# EAGLE design OnOnfre_dual_parafuso_estores_beta (EAGLE 8.6.0)
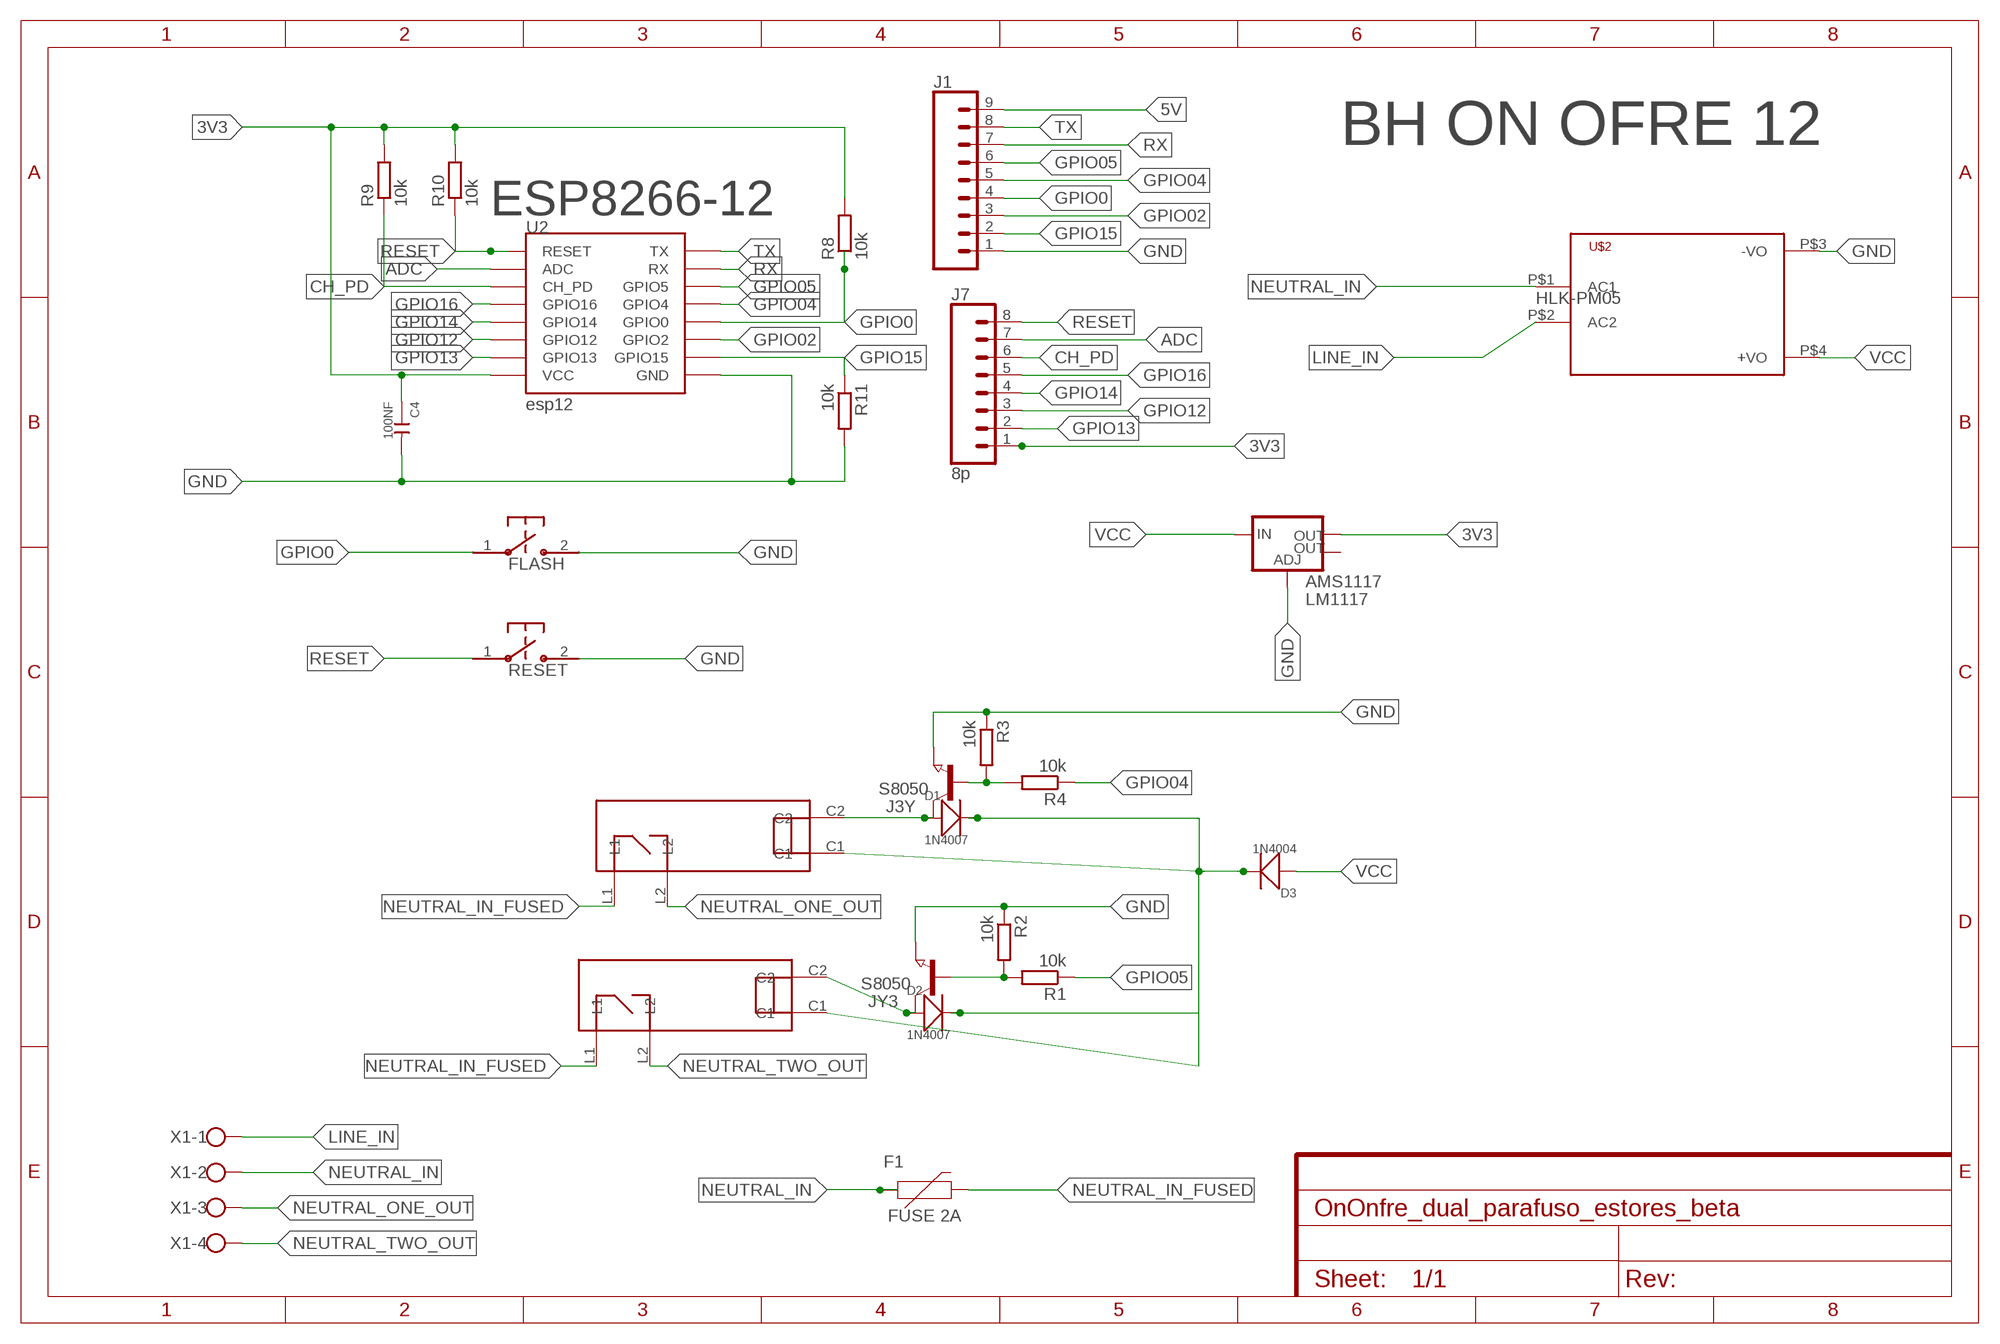
[diagram p0: schematic, sheet 1]

## Parts
AMS1117  LM1117  V_REG_LM1117SOT223  [SOT223]
C4  100NF  CERAMIC-1NF-1KV-10%-X7R(1206)  [C1206]
D1  1N4007  DIODE-GEN-PURPOSE-1KV-1A(DO-214AC)  [DO-214AC]
D2  1N4007  DIODE-GEN-PURPOSE-1KV-1A(DO-214AC)  [DO-214AC]
D3  1N4004  DIODE-GEN-PURPOSE-1KV-1A(DO-214AC)  [DO-214AC]
F1  FUSE 2A  PPTC_PTH  [PTH]
FLASH  B3U-1000P-2P-SMD  B3U-1000P  [B3U-1000P]
J1  CONN_09  [1X09]
J3Y  S8050  NPN-TRANSISTOR_SOT23  [SOT23]
J7  8p  CONN_08"  [1X08]
JY3  S8050  NPN-TRANSISTOR_SOT23  [SOT23]
R1  10k  R-EU_R0603  [R0603]
R2  10k  R-EU_R0603  [R0603]
R3  10k  R-EU_R0603  [R0603]
R4  10k  R-EU_R0603  [R0603]
R8  10k  R-EU_R0603  [R0603]
R9  10k  R-EU_R0603  [R0603]
R10  10k  R-EU_R0603  [R0603]
R11  10k  R-EU_R0603  [R0603]
RESET  B3U-1000P-2P-SMD  B3U-1000P  [B3U-1000P]
U2  esp12  ESP12SMD  [ESP12-SMD]
U$1  HF46F  [HF46F]
U$2  HKLPM01  [HKLPM01]
U$3  HF46F  [HF46F]
X1  W237-4  [W237-4]

## Nets
3V3: AMS1117.2(OUT) C4.1 J7.1 R8.2 R9.2 R10.2 U2.VCC
5V: D1.2(-) D2.2(-) D3.2(-) J1.9 U$1.C1 U$3.C1
ADC: J7.7 U2.ADC
CH_PD: J7.6 R9.1 U2.CH_PD
GND: AMS1117.1(ADJ) C4.2 FLASH.2 J1.1 J3Y.2(E) JY3.2(E) R2.1 R3.1 R11.2 RESET.2 U2.GND U$2.P$3(-VO)
GPIO0: FLASH.1 J1.4 R8.1 U2.GPIO0
GPIO02: J1.3 U2.GPIO2
GPIO04: J1.5 R4.1 U2.GPIO4
GPIO05: J1.6 R1.1 U2.GPIO5
GPIO12: J7.3 U2.GPIO12
GPIO13: J7.2 U2.GPIO13
GPIO14: J7.4 U2.GPIO14
GPIO15: J1.2 R11.1 U2.GPIO15
GPIO16: J7.5 U2.GPIO16
LINE_IN [220V]: U$2.P$2(AC2) X1.1
N$1: D1.1(+) J3Y.3(C) U$1.C2
N$7: J3Y.1(B) R3.2 R4.2
N$9: D2.1(+) JY3.3(C) U$3.C2
N$13: JY3.1(B) R1.2 R2.2
NEUTRAL_IN [220V]: F1.P$1 U$2.P$1(AC1) X1.2
NEUTRAL_IN_FUSED: F1.P$2 U$1.L1 U$3.L1
NEUTRAL_ONE_OUT [220V]: U$1.L2 X1.3
NEUTRAL_TWO_OUT [220V]: U$3.L2 X1.4
RESET: J7.8 R10.1 RESET.1 U2.RESET
RX: J1.7 U2.RXD0(RX)
TX: J1.8 U2.TXD0(TX)
VCC: AMS1117.3(IN) D3.1(+) U$2.P$4(+VO)
Unconnected: AMS1117.4(OUT)

## Notes on the sheet
- BH ON OFRE 12
- ESP8266-12
- HLK-PM05

## Library data of the parts
AMS1117 = SparkFun-IC-Power:V_REG_LM1117: Voltage Regulator LM1117 Standard adjustable voltage regulator but in SMD form. Spark Fun Electronics SKU : COM-00595; PROD_ID: VREG-08170
C4 = Seeed-Capacitor:CERAMIC-1NF-1KV-10%-X7R?(1206): 302010189; MPN: CC1206KKX7RCBB102; VALUE: 1NF
D1 D2 = Seeed-Diode:DIODE-GEN-PURPOSE-1KV-1A(DO-214AC): 304010013; MPN: 1N4007
D3 = Seeed-Diode:DIODE-GEN-PURPOSE-1KV-1A(DO-214AC): 304010013; MPN: 1N4007; VALUE: 1N4007
F1 = SparkFun-Fuses:PPTC: Resettable Fuse PPTC Resettable Fuse. Really a sort of resistor with a polymeric positive temperature coefficient whose resistance increases dramatically with an increase in temperature. When heated by the power passing through the resistance rises causing the current to be limited, protecting the circuit. This is achieved by the transition of the polymer from a crystalline to an amorphous state where the conductive carbon separates breaking the conductive pathways found in the cool crystalline structure. When a PPTC cools back down it resumes conducting letting the circuit turn back on. SparkFun Products: SparkFun RedBoard - Programmed with Arduino <https://www.sparkfun.com/products/12757> Pro Micro - 5V/16MHz <https://www.sparkfun.com/products/12640> Arduino Pro 328 - 5V/16MHz <https://www.sparkfun.com/products/10915> MP3 Trigger <https://www.sparkfun.com/products/13720>; PROD_ID: RES-08490; VALUE: 72V/0.25A
FLASH RESET = switches:B3U: Switch; DIGIKEY: SW1020CT-ND; MANUFACTURER: Omron; MPN: B3U-1000P
J1 = SparkFun-Connectors:CONN_09: Multi connection point. Often used as Generic Header-pin footprint for 0.1 inch spaced/style header connections On any of the 0.1 inch spaced packages, you can populate with these: Break Away Headers - Straight <https://www.sparkfun.com/products/116> (PRT-00116) Break Away Male Headers - Right Angle <https://www.sparkfun.com/products/553> (PRT-00553) Female Headers <https://www.sparkfun.com/products/115> (PRT-00115) Break Away Headers - Machine Pin <https://www.sparkfun.com/products/117> (PRT-00117) Break Away Female Headers - Swiss Machine Pin <https://www.sparkfun.com/products/743> (PRT-00743) For SCREWTERMINALS and SPRING TERMINALS visit here: Screw Terimnals on SparkFun.com <https://www.sparkfun.com/search/results?term=Screw+Terminals> (5mm/3.5mm/2.54mm spacing) This device is also useful as a general connection point to wire up your design to another part of your project. Our various solder wires solder well into these plated through hole pads. Hook-Up Wire - Assortment (Stranded, 22 AWG) <https://www.sparkfun.com/products/11375> (PRT-11375) Hook-Up Wire - Assortment (Solid Core, 22 AWG) <https://www.sparkfun.com/products/11367> (PRT-11367) View the entire wire category on our website here <https://www.sparkfun.com/categories/141> Special notes: Molex polarized connector foot print use with SKU : PRT-08231 with associated crimp pins and housings. 1MM SMD Version SKU: PRT-10208 NOTES ON THE VARIANTS LOCK and LOCK_LONGPADS... This footprint was designed to help hold the alignment of a through-hole component (i.e. 6-pin header) while soldering it into place. You may notice that each hole has been shifted either up or down by 0.005 of an inch from it's more standard position (which is a perfectly straight line). This slight alteration caused the pins (the squares in the middle) to touch the edges of the holes. Because they are alternating, it causes a "brace" to hold the component in place. 0.005 has proven to be the perfect amount of "off-center" position when using our standard breakaway headers. Although looks a little odd when you look at the bare footprint, once you have a header in there, the alteration is very hard to notice. Also,if you push a header all the way into place, it is covered up entirely on the bottom side.
J3Y JY3 = semicon-smd-ipc:NPN-TRANSISTOR_: NPN TRANSISTOR
J7 = SparkFun-Connectors:CONN_08: Multi connection point. Often used as Generic Header-pin footprint for 0.1 inch spaced/style header connections On any of the 0.1 inch spaced packages, you can populate with these: Break Away Headers - Straight <https://www.sparkfun.com/products/116> (PRT-00116) Break Away Male Headers - Right Angle <https://www.sparkfun.com/products/553> (PRT-00553) Female Headers <https://www.sparkfun.com/products/115> (PRT-00115) Break Away Headers - Machine Pin <https://www.sparkfun.com/products/117> (PRT-00117) Break Away Female Headers - Swiss Machine Pin <https://www.sparkfun.com/products/743> (PRT-00743) Arduino Stackable Header - 8 Pin <https://www.sparkfun.com/products/9279> (PRT-09279) For SCREWTERMINALS and SPRING TERMINALS visit here: Screw Terimnals on SparkFun.com <https://www.sparkfun.com/search/results?term=Screw+Terminals> (5mm/3.5mm/2.54mm spacing) This device is also useful as a general connection point to wire up your design to another part of your project. Our various solder wires solder well into these plated through hole pads. Hook-Up Wire - Assortment (Stranded, 22 AWG) <https://www.sparkfun.com/products/11375> (PRT-11375) Hook-Up Wire - Assortment (Solid Core, 22 AWG) <https://www.sparkfun.com/products/11367> (PRT-11367) View the entire wire category on our website here <https://www.sparkfun.com/categories/141> Special notes: Molex polarized connector foot print use with SKU : PRT-08231 with associated crimp pins and housings. 1MM SMD Version SKU: PRT-10208 NOTES ON THE VARIANTS LOCK and LOCK_LONGPADS... This footprint was designed to help hold the alignment of a through-hole component (i.e. 6-pin header) while soldering it into place. You may notice that each hole has been shifted either up or down by 0.005 of an inch from it's more standard position (which is a perfectly straight line). This slight alteration caused the pins (the squares in the middle) to touch the edges of the holes. Because they are alternating, it causes a "brace" to hold the component in place. 0.005 has proven to be the perfect amount of "off-center" position when using our standard breakaway headers. Although looks a little odd when you look at the bare footprint, once you have a header in there, the alteration is very hard to notice. Also,if you push a header all the way into place, it is covered up entirely on the bottom side.; PROD_ID: CONN-08438
R1-R4 R8-R11 = resistor:R-EU_: RESISTOR, European symbol
U2 = esp8266modules:ESP12: ESP8266 Wifi module 12
U$1 U$3 = HF46F:HF46F
U$2 = HKLPM01:HKLPM01
X1 = con-wago-500:W237-4: WAGO SCREW CLAMP; OC_FARNELL: unknown; OC_NEWARK: unknown

## Net classes
1 220V: width 1.27 mm, clearance 2 mm

## Board
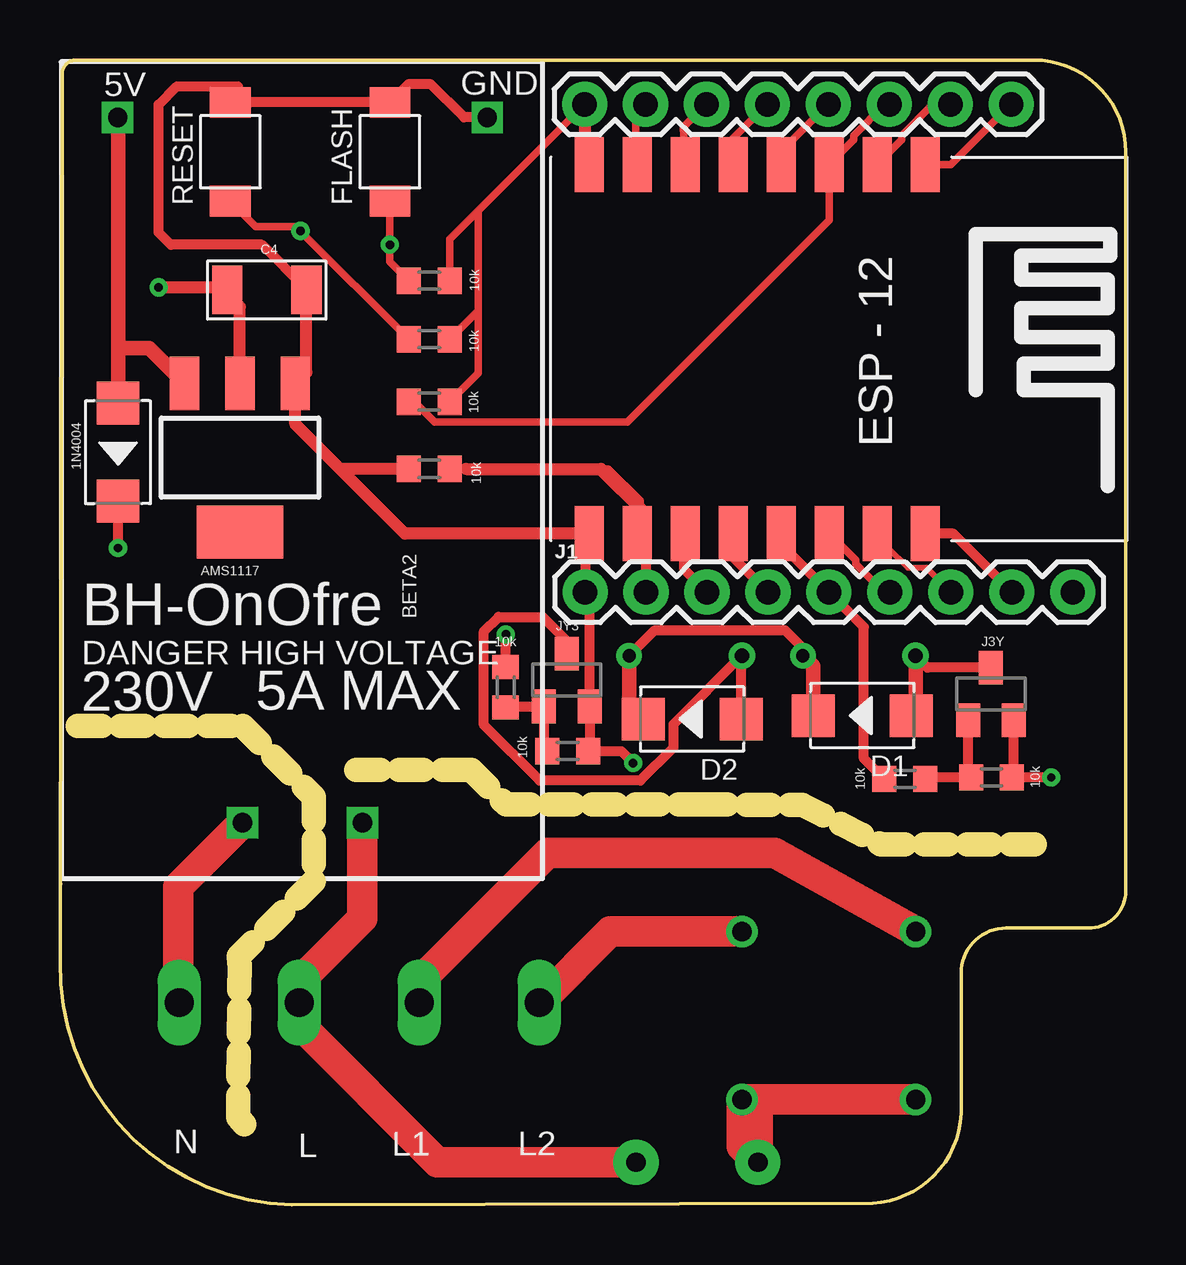
[diagram p1: board, top side]
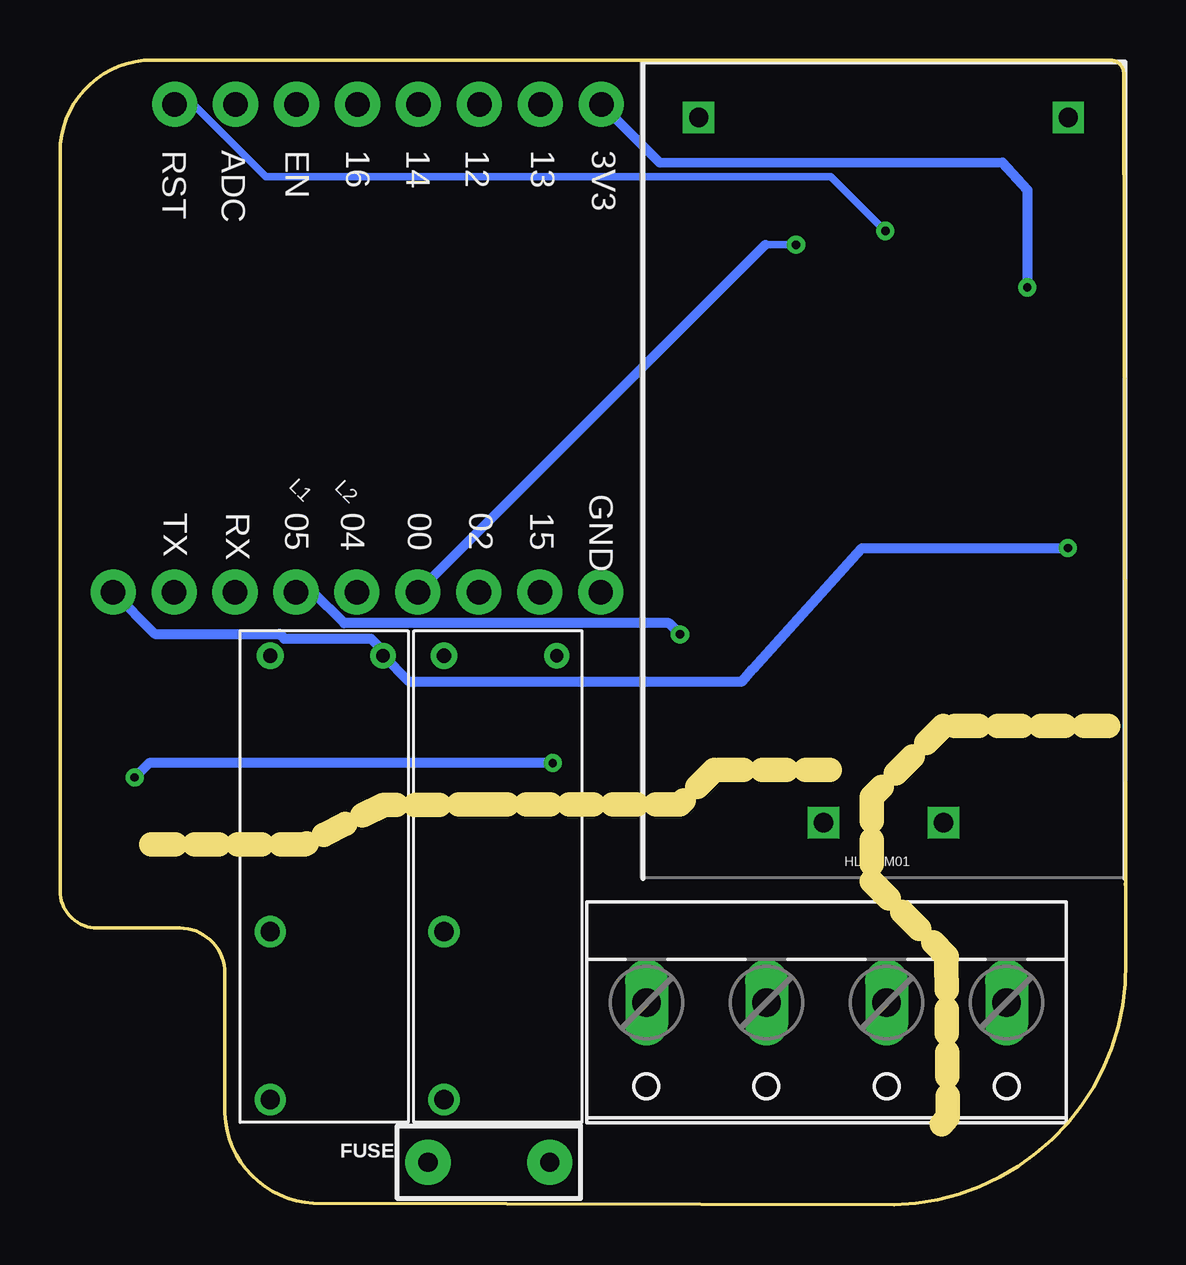
[diagram p2: board, bottom side, seen from below]

Size 44.41 x 47.73 mm. Coordinates in mm from the lower left corner, seen from the top.
Outline: 0.01,13.43 0.01,13.34
Outline: 0.01,13.34 0.01,10.14 arc90 9.66,0 33.86,0.08 arc90 37.54,4.18 37.54,9.66 arc-90 39.42,11.54 42.86,11.54 arc90 44.41,13.1 44.41,43.89 arc90 40.57,47.73 0.67,47.73 arc90 0.09,47.16 0,13.43 arc-90 0.01,13.34
Copper layers (1*16): Top 0.035mm / dielectric 1.5mm / Bottom 0.035mm
Design rules "default": minimum track width 6mil, minimum drill 0.35mm, track to track 6mil, track to pad 6mil, pad to pad 6mil, via to via 6mil, smd to smd 6mil, copper to edge 40mil, drill to drill 6mil, minimum pad ring 10mil, minimum via ring 8mil, stop-mask expansion 4mil, vias tented up to drill 0mil, thermal gap 10mil
Milling: 38 lines

### Footprints (pad centres in the part's own frame; a part is rotated, then mirrored left to right if it is on the bottom)
SOT223 = smd 1.219 x 2.235: 1 -2.311,-3.099; 2 0,-3.099; 3 2.311,-3.099 | smd 3.6 x 2.2: 4 0,3.099
C1206 = smd 1.27 x 2.032: 1 -1.651,0; 2 1.651,0
DO-214AC = smd 1.8 x 1.77: 1 -2.042,0; 2 2.042,0
PTH = drill 0.8 pad 1.88: P$1 -2.54,0; P$2 2.54,0
B3U-1000P = smd 1.283 x 1.7: 1 -2.056,0; 2 2.056,0
1X09 = drill 1.016 pad 1.88: 1 0,0; 2 2.54,0; 3 5.08,0; 4 7.62,0; 5 10.16,0; 6 12.7,0; 7 15.24,0; 8 17.78,0; 9 20.32,0
SOT23 = smd 1 x 1.4: 1 -0.95,-1.1; 2 0.95,-1.1; 3 0,1.1
1X08 = drill 1.016 pad 1.88: 1 0,0; 2 2.54,0; 3 5.08,0; 4 7.62,0; 5 10.16,0; 6 12.7,0; 7 15.24,0; 8 17.78,0
R0603 = smd 1 x 1.1: 1 -0.85,0; 2 0.85,0
ESP12-SMD = smd 2.286 x 1.2: ADC -7.792,3.8; CH_PD -7.792,1.8; GND 7.592,-8.2; GPIO0 7.592,-2.2; GPIO2 7.592,-4.2; GPIO4 7.592,-0.2; GPIO5 7.592,1.8; GPIO12 -7.792,-4.2; GPIO13 -7.792,-6.2; GPIO14 -7.792,-2.2; GPIO15 7.592,-6.2; GPIO16 -7.792,-0.2; RESET -7.792,5.8; RXD0 7.592,3.8; TXD0 7.592,5.8; VCC -7.792,-8.2
HF46F = drill 0.55: C1 1.05,1.05 | drill 0.6: C2 5.75,1.05 | drill 0.8: L1 5.75,19.55; L2 5.75,12.55
HKLPM01 = drill 0.8 square: P$1 -14.7,2.5; P$2 -14.7,-2.5; P$3 14.7,7.7; P$4 14.7,-7.7
W237-4 = drill 1.194 long: 1 -7.5,-1.27; 2 -2.5,-1.27; 3 2.5,-1.27; 4 7.5,-1.27

### Placement (x,y rotation side)
AMS1117  7.5,31.15 180 top
C4  8.62,38.14 0 top
D1  33.43,20.4 180 top
D2  26.34,20.26 180 top
D3  2.42,31.38 270 top
F1  FUSE  [PTH]  26.54,1.78 180 bottom
FLASH  13.75,43.9 90 top
J1  21.88,25.55 0 top
J3Y  38.79,21.3 0 top
J7  21.86,45.88 0 top
JY3  21.12,21.88 0 top
R1  18.57,21.58 270 top
R2  21.15,18.92 180 top
R3  38.81,17.82 180 top
R4  35.2,17.76 0 top
R8  15.38,38.53 0 top
R9  15.38,33.48 0 top
R10  15.38,36.09 0 top
R11  15.38,30.69 180 top
RESET  7.1,43.9 90 top
U2  30.25,35.58 270 top
U$1  29.9,23.95 180 bottom
U$2  10.1,30.64 90 bottom
U$3  22.66,23.95 180 bottom
X1  12.47,7.16 180 bottom

### Tracks (layer width: path | path; a pad name or v marks a point on that pad's centre or on a via)
3V3  (via drill 0.35)
  Top 0.305: 6.97,37.96 C4.1 | R8.2 16.23,40.26 17.42,41.45 | 17.42,41.45 J7.1 | R10.2 17.42,37.27 | 17.42,37.27 17.42,41.45 | R9.2 17.42,34.67 17.42,37.27
  Top 0.508: J7.1 21.86,43.42 U2.VCC | AMS1117.2 7.5,37.43 6.97,37.96 | C4.1 6.86,38.25 v4.11,38.25
  Bottom 0.406: J7.1 19.42,43.45 5.14,43.47 4.11,42.31 v4.11,38.25
5V  (via drill 0.35)
  Top 0.406: U$3.C1 24.78,23.96 30.2,23.96 30.95,23.21 U$1.C1 | v2.42,27.38 D3.2
  Top 0.61: U$3.C1 23.71,20.84 D2.2 | U$1.C1 31.39,22.46 D1.2
  Bottom 0.406: J1.9 40.46,23.81 35.27,23.81 35.07,23.6 31.46,23.6 30.95,23.1 U$1.C1 29.88,21.82 15.98,21.82 15.54,22.34 11,27.38 v2.42,27.38
ADC
  Top 0.305: U2.ADC 35.07,44.4 35.07,44.58 36.37,45.88 J7.7
CH_PD
  Top 0.305: J7.6 34.37,45.88 33.07,44.58 33.07,44.4 U2.CH_PD 32.05,41.05 23.63,32.63 15.61,32.63 14.75,33.48 R9.1
GND  (via drill 0.35)
  Top 0.305: 10.27,38.03 C4.2 10.27,38.18 | 7.41,46.63 7.41,46.47 7.92,45.96
  Top 0.406: U$2.P$3 16.83,45.34 15.45,46.71 14.5,46.71 FLASH.2 7.92,45.96 RESET.2 | 10.27,38.18 8.43,40.03 4.62,40.03 4.11,40.54 4.11,45.87 4.87,46.63 7.41,46.63 | U2.GND 21.88,27.81 21.88,25.72 | 21.88,25.72 J1.1 | 21.88,25.72 22.07,25.54 JY3.2 22.07,18.99 R2.1 23.38,18.92 v23.88,18.42 | J3Y.2 39.74,17.9 R3.1 v41.3,17.82
  Top 0.508: 10.27,38.03 10.27,34.71 AMS1117.1 9.81,32.55 11.67,30.69 | U2.GND 14.37,27.99 11.67,30.69 | R11.2 11.67,30.69
  Bottom 0.406: v23.88,18.42 40.7,18.42 v41.3,17.82
GPIO0  (via drill 0.35)
  Top 0.305: 27.97,27.07 28,27.35 U2.GPIO0 | R8.1 13.75,39.31 v13.75,40.03 FLASH.1
  Top 0.406: J1.4 28,27.05 28,27.35
  Bottom 0.305: v13.75,40.03 15.02,40.03
  Bottom 0.406: 15.02,40.03 J1.4
GPIO02
  Top 0.305: 25.97,26.53 26.02,27.32 U2.GPIO2
  Top 0.406: J1.3 26.02,26.49 26.02,27.32
GPIO04
  Top 0.406: U2.GPIO4 30.05,27.53 31.9,25.68 J1.5 33.5,24.09 33.5,18.61 R4.1
GPIO05  (via drill 0.35)
  Top 0.305: U2.GPIO5 33.15,26.89 33.15,26.72 34.32,25.55 J1.6
  Top 0.406: R1.1 v18.57,23.78 v18.58,23.78
  Bottom 0.406: J1.6 33.87,25.55 32.58,24.25 19.04,24.25 v18.58,23.78
GPIO12
  Top 0.305: U2.GPIO12 25.97,44.92 J7.3
GPIO13
  Top 0.305: U2.GPIO13 23.97,45.46 J7.2
GPIO14
  Top 0.305: U2.GPIO14 27.97,44.38 J7.4
GPIO15
  Top 0.305: R11.1 16.93,30.69 | 22.54,30.69 22.85,30.69 24.17,29.36 24.17,28.34 24.42,28.1 24.42,27.62 24.42,27.33 | U2.GPIO15
  Top 0.406: J1.2 24.42,27.62 24.34,27.7 U2.GPIO15
  Top 0.508: 16.93,30.69 22.54,30.69 24.34,28.88 24.34,27.7
GPIO16
  Top 0.305: U2.GPIO16 29.97,43.84 J7.5
LINE_IN
  Top 1.27: U$2.P$2 4.92,13.25 4.92,8.38 | 4.92,7.74 4.92,8.38 | 4.92,8.38 X1.1
N$1
  Top 0.406: J3Y.3 36.14,22.4 U$1.C2
  Top 0.61: U$1.C2 35.65,20.58 D1.1
N$7
  Top 0.406: R4.2 36.12,17.82 R3.2 37.84,17.94 J3Y.1
N$9
  Top 0.406: D2.1 28.38,22.86 U$3.C2 25.55,20.04 25.55,19.06 24.18,17.69 19.98,17.69 17.66,20.01 17.66,23.91 18.27,24.52 20.09,24.52 20.1,24.52 21.12,23.51 JY3.3
N$13
  Top 0.406: R1.2 18.62,20.78 JY3.1 20.17,19.06 R2.2
NEUTRAL_IN
  Top 1.27: F1.P$1 15.73,1.78 9.97,7.55 X1.2 9.97,9.32 12.6,11.96 U$2.P$1
NEUTRAL_IN_FUSED
  Top 1.27: U$3.L1 29.08,3.73 F1.P$2 | U$1.L1 | U$1.L1 U$3.L1 | F1.P$2 28.41,2.45 U$3.L1
NEUTRAL_ONE_OUT
  Top 1.27: X1.3 14.97,9.32 20.33,14.68 29.78,14.68 35.66,11.4 U$1.L2
NEUTRAL_TWO_OUT
  Top 1.27: X1.4 22.93,11.4 U$3.L2
RESET  (via drill 0.35)
  Top 0.305: RESET.1 8.16,40.79 9.83,40.79 v10.02,40.6 R10.1 | U2.RESET 37.12,43.37 J7.8
  Bottom 0.305: v10.02,40.6 12.29,42.87 35.85,42.87 38.86,45.88 J7.8
RX
  Top 0.254: U2.RXD0 33.99,27.92 33.99,27.38 34.52,27.38 35.34,26.56 36.1,26.56 J1.7
TX
  Top 0.406: J1.8 37.22,27.99 U2.TXD0
VCC
  Top 0.61: D3.1 2.42,35.72 | 2.42,35.72 2.42,45.32 U$2.P$4 | 2.42,35.72 3.72,35.72 AMS1117.3

### Text on the board
tNames: 5V | GND | BH-OnOfre | BETA2 | DANGER HIGH VOLTAGE | 230V | 5A MAX | N | L1 | L | L2
bNames: 3V3 | 13 | 12 | 14 | 16 | EN | ADC | RST | GND | L2 | L1 | 15 | 02 | 00 | 04 | 05 | RX | TX | HLK-PM01